# Altium schematic sheet Sheet1.SchDoc
size A; SheetNumber: 1; SheetTotal: 1
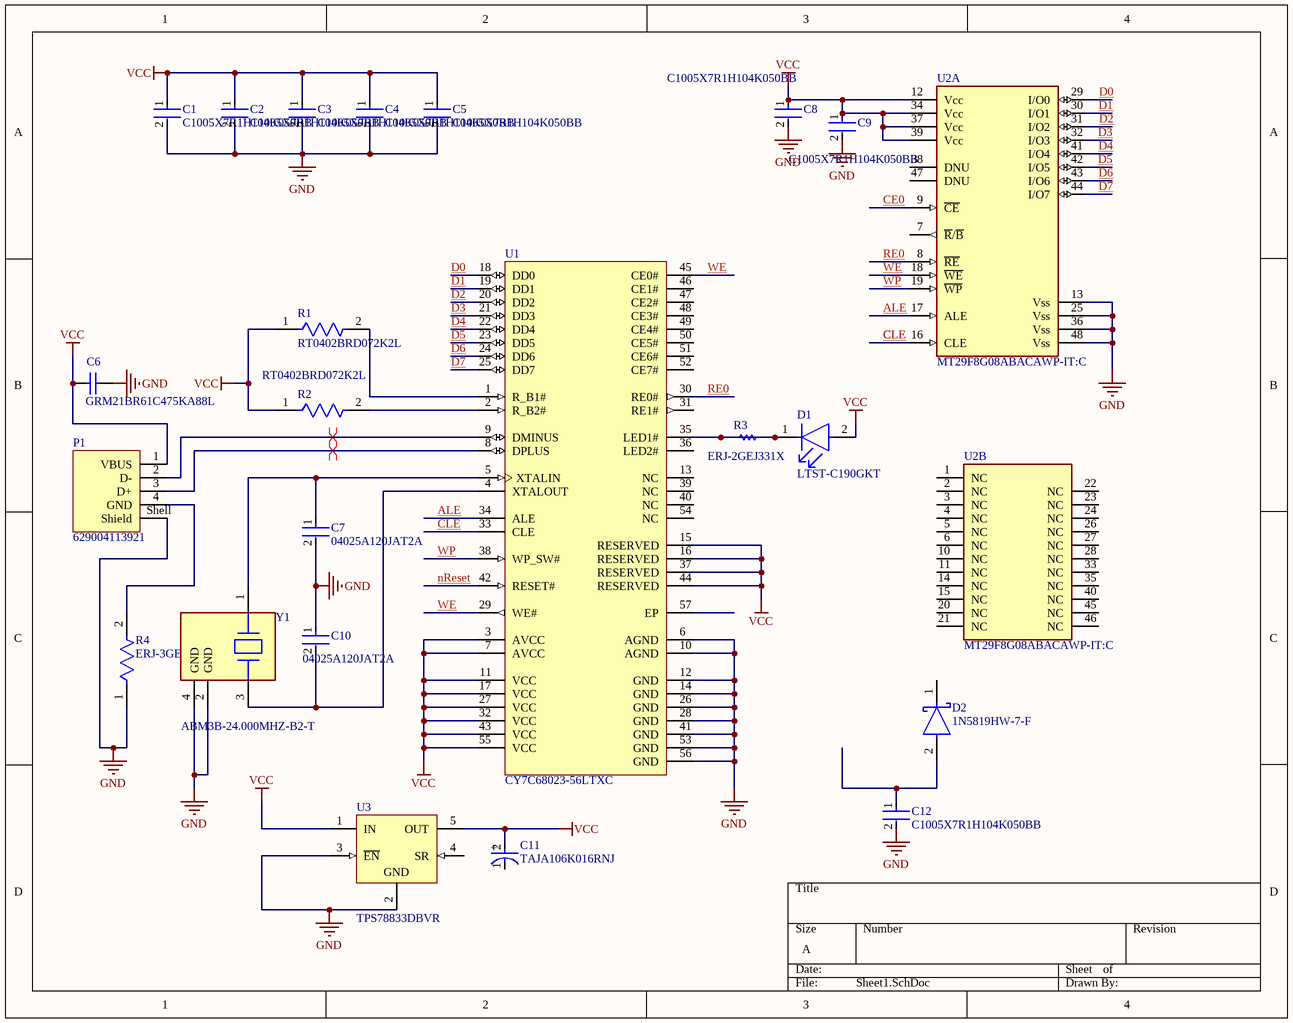
[diagram p0: Sheet1.SchDoc]

## Parts
C1  C1005X7R1H104K050BB  [FP-C1005-050-0_05-IPC_C]
C2  C1005X7R1H104K050BB  [FP-C1005-050-0_05-IPC_C]
C3  C1005X7R1H104K050BB  [FP-C1005-050-0_05-IPC_C]
C4  C1005X7R1H104K050BB  [FP-C1005-050-0_05-IPC_C]
C5  C1005X7R1H104K050BB  [FP-C1005-050-0_05-IPC_C]
C6  GRM21BR61C475KA88L  [CAPC2013X135X45LL10T25]
C7  04025A120JAT2A  [FP-0402-L_1_0_1-W_0_5_0_1-IPC_B]
C8  C1005X7R1H104K050BB  [FP-C1005-050-0_05-IPC_C]
C9  C1005X7R1H104K050BB  [FP-C1005-050-0_05-IPC_C]
C10  04025A120JAT2A  [FP-0402-L_1_0_1-W_0_5_0_1-IPC_B]
C11  TAJA106K016RNJ  [FP-TAJA-MFG]
C12  C1005X7R1H104K050BB  [FP-C1005-050-0_05-IPC_C]
D1  LTST-C190GKT  [FP-LTST-C190GKT-MFG]
D2  1N5819HW-7-F  [FP-SOD123-IPC_A]
P1  629004113921  [629004113921]
R1  RT0402BRD072K2L  [FP-RT0402-MFG]
R2  RT0402BRD072K2L  [FP-RT0402-MFG]
R3  ERJ-2GEJ331X  [RESC1005X40X25NL05T05]
R4  ERJ-3GEY0R00V  [FP-ERJ-3GEY0R00V-MFG]
U1  CY7C68023-56LTXC  [CYP-LTX56-5200X4500TP_M]
U2  MT29F8G08ABACAWP-IT:C  [FP-WP-IPC_C]  (parts A,B of 2)
U3  TPS78833DBVR  [DBV0005A_M]
Y1  ABM3B-24.000MHZ-B2-T  [FP-ABM3B-MFG]

## Nets
GND: C1.2 C2.2 C3.2 C4.2 C5.2 C6.2 C7.2 C8.2 C9.2 C10.1 C12.2 P1.Shell(Shield) R4.1 U1.6(AGND) U1.10(AGND) U1.12(GND) U1.14(GND) U1.26(GND) U1.28(GND) U1.41(GND) U1.53(GND) U1.56(GND) U2.13(Vss) U2.25(Vss) U2.36(Vss) U2.48(Vss) U3.2(GND) U3.3(~{EN}) Y1.2(GND) Y1.4(GND)
VCC: C1.1 C2.1 C3.1 C4.1 C5.1 C6.1 C8.1 C9.1 C11.2(A) D1.2(A) P1.1(VBUS) R1.1 R2.1 U1.3(AVCC) U1.7(AVCC) U1.11(VCC) U1.15(RESERVED) U1.16(RESERVED) U1.17(VCC) U1.27(VCC) U1.32(VCC) U1.37(RESERVED) U1.43(VCC) U1.44(RESERVED) U1.55(VCC) U2.12(Vcc) U2.34(Vcc) U2.37(Vcc) U2.39(Vcc) U3.1(IN) U3.5(OUT)
ALE: U1.34(ALE) U2.17(ALE)
CE0: U2.9(~{CE})
CLE: U1.33(CLE) U2.16(CLE)
D0: U1.18(DD0) U2.29(I/O0)
D1: U1.19(DD1) U2.30(I/O1)
D2: U1.20(DD2) U2.31(I/O2)
D3: U1.21(DD3) U2.32(I/O3)
D4: U1.22(DD4) U2.41(I/O4)
D5: U1.23(DD5) U2.42(I/O5)
D6: U1.24(DD6) U2.43(I/O6)
D7: U1.25(DD7) U2.44(I/O7)
nReset: U1.42(RESET#)
RE0: U1.30(RE0#) U2.8(~{RE})
WE: U1.29(WE#) U1.45(CE0#) U2.18(~{WE})
WP: U1.38(WP_SW#) U2.19(~{WP})
NetC7_1: C7.1 U1.5(XTALIN) Y1.1
NetC10_2: C10.2 U1.4(XTALOUT) Y1.3
NetC12_1: C12.1 D2.2(A)
NetD1_1: D1.1(C) R3.1 R3.2 U1.35(LED1#)
NetP1_2: P1.2(D-) U1.9(DMINUS)
NetP1_3: P1.3(D+) U1.8(DPLUS)
NetP1_4: P1.4(GND) R4.2
NetR1_2: R1.2 U1.1(R_B1#)
NetR2_2: R2.2 U1.2(R_B2#)

Not connected (* = marked no-connect by the designer): C11 1(C); D2 1(C); U1 13(NC) 31(RE1#) 36(LED2#) 39(NC) 40(NC) 46(CE1#) 47(CE2#) 48(CE3#) 49(CE4#) 50(CE5#) 51(CE6#) 52(CE7#) 54(NC) 57(EP); U2 1(NC) 2(NC) 3(NC) 4(NC) 5(NC) 6(NC) 7(~{R}/~{B}) 10(NC) 11(NC) 14(NC) 15(NC) 20(NC) 21(NC) 22(NC) 23(NC) 24(NC) 26(NC) 27(NC) 28(NC) 33(NC) 35(NC) 38(DNU) 40(NC) 45(NC) 46(NC) 47(DNU); U3 4(SR)

## Layout directives
differential pair: NetP1_2, NetP1_3

## Notes on the sheet
- (in symbol CMP-1661-00004-2) +

## Library data of the parts
C1-C5 C8 C9 C12 = CMP-2000-05393-2: Multilayer Ceramic Capacitors 100nF ±10% 50V X7R SMD 0402; Voltage: 50V; Dielectric Material: Ceramic; Min Operating Temperature: -55°C; Depth: 0.5mm; Radiation Hardening: No; RoHS Compliant: Yes; Voltage Rating (DC): 50V; Lead Free: Lead Free; Resistor Type: Ceramic; Height: 0.5mm; Dielectric: X7R; Thickness: 0.022inch; Case/Package: 0402; Case Code (Metric): 1005; Termination: SMD/SMT; Capacitance: 100nF; Packaging: Tape and Reel; Max Operating Temperature: 125°C; Mount: Surface Mount; Package Quantity: 1; Width: 0.02inch; Weight: 2.3E-05oz; Voltage Rating: 50V; Tolerance: 10%; Construction: Flat; Case Code (Imperial): 0402; Length: 1mm; REACH SVHC: No SVHC; Series: C
C6 = CMP-1662-00015-2: Chip Capacitor, 4.7 uF, +/- 10%, 16 V, -55 to 85 degC, 0805 (2012 Metric), RoHS, Tape and Reel; Voltage Rating (DC): 16 V; Capacitance: 4.7 uF; Type (Capacitors): X5R; Case\/Package: 0805; Pins: 2; DatasheetVersion: 03/2016; REACH SVHC: No SVHC; Tolerance: 10%; PartNumber: GRM21BR61C475KA88L; Width: 1.25 mm; Mount: Surface Mount; ComponentLink1Description: Manufacturer URL; Case Code (Metric): 2012; PackageDescription: 2-Pin Surface Mount Device, Body 2 x 1.25 mm; Height: 1.25 mm; Voltage Rating: 16 V; Max Operating Temperature: 85 degC; RoHSCompliant: true; Length: 2 mm; ComponentLink1URL: http://www.murata.com/; Mounting Technology: Surface Mount; Packaging: Tape and Reel; Min Operating Temperature: -55 degC; ComponentLink2Description: Datasheet; Case Code (Imperial): 0805; Radiation Hardening: No; Package Quantity: 3000; PackageReference: 0805; ComponentLink2URL: http://search.murata.co.jp/Ceramy/image/img/A01X/G101/ENG/GRM21BR61C475KA88-01.pdf
C7 C10 = CMP-2008-02574-2: General Purpose Ceramic Capacitor, 0402, 12pF, 5%, C0G, 30ppm/°C, 50V; Insulation Resistance: 100GR; Radiation Hardening: No; RoHS Compliant: Yes; Voltage Rating: 50V; Case Code (Imperial): 0402; Height: 0.5mm; Voltage: 50V; Voltage Rating (DC): 50V; Mount: Surface Mount; Capacitance: 12pF; Thickness: 0.022inch; Depth: 0.5mm; Max Operating Temperature: 125°C; Construction: Flat; Termination: SMD/SMT; Tolerance: 5%; Length: 1mm; Lead Free: Lead Free; Dielectric: C0G; Number of Pins: 2; Package Quantity: 1; Series: -; Temperature Coefficient: 30ppm/°C; Min Operating Temperature: -55°C; Case/Package: 0402; Packaging: Tape and Reel; Case Code (Metric): 1005; Width: 0.02inch; REACH SVHC: No SVHC
C11 = CMP-1661-00004-2: 10uF 16V  ±10% 3Ω 1206  SMD Tantalum Capacitor; ESR (Equivalent Series Resistance): 3R; Leakage Current: 1.6uA; Dissipation Factor: 8%; Polarity: Polar; Length: 3.2mm; Features: General Purpose; Voltage Rating: 16V; Voltage: 16V; Mount: Surface Mount; Case/Package: 1206; Number of Pins: 2; Case Code (Metric): 3216; Radiation Hardening: No; Min Operating Temperature: -55°C; Case Code (Imperial): 1206; Height - Seated (Max): 0.071inch; Lead Free: Lead Free; Termination: SMD/SMT; Dielectric Material: Tantalum; Width: 1.6mm; Tolerance: 10%; Capacitance: 10uF; Lead Pitch: 1.1mm; Max Operating Temperature: 125°C; Voltage Rating (DC): 16V; Packaging: Tape and Reel; Package Quantity: 1; REACH SVHC: No SVHC; Depth: 1.6mm; Height: 1.6mm
D1 = CMP-22017-000005-2: LED GREEN CLEAR CHIP SMD; Dominant Wavelength: 569nm; Reverse Voltage: 5V; Lens Color: Colorless; Viewing Angle: 130°; Voltage: 2V; Forward Current: 30mA; Power Dissipation: 100mW; Luminous Intensity: 6mcd; Number of LEDs: 1; Forward Voltage: 2.1V; Wavelength: 565nm; Test Current: 10mA; Min Operating Temperature: -55°C; Lens Style: Clear; Mount: Surface Mount; Width: 0.8mm; Packaging: Tape and Reel; Lens Transparency: Clear; Case Code (Metric): 1608; Depth: 0.8mm; Case Code (Imperial): 0603; Case/Package: 0603; Number of Pins: 2; Max Operating Temperature: 85°C; Lead Free: Lead Free; Number of Elements: 1; Length: 1.6mm; Height: 0.8mm; Package Quantity: 1; Power Rating: 100mW; Radiation Hardening: No; Illumination Color: Green; Color: Green
D2 = CMP-0303-00003-3: DIODE SCHOTTKY 40V 1A SOD123; Forward Voltage: 450mV; Capacitance: 110pF; Max Forward Surge Current (Ifsm): 25A; Peak Reverse Current: 50uA; Polarity: Standard; Element Configuration: Single; Max Power Dissipation: 450mW; Min Operating Temperature: -65°C; Package Quantity: 3000; Contact Plating: Tin; Weight: 0.000353oz; Max Repetitive Reverse Voltage (Vrrm): 40V; Max Reverse Voltage (DC): 40V; Height: 1.25mm; Average Rectified Current: 1A; Width: 1.7mm; Case/Package: SOD-123-2; Lead Free: Lead Free; Max Operating Temperature: 125°C; Current Rating: 1A; Termination: SMD/SMT; Forward Current: 1A; Radiation Hardening: No; Number of Pins: 2; Length: 2.85mm; Voltage Rating (DC): 40V; REACH SVHC: No SVHC; Peak Non-Repetitive Surge Current: 25A; Packaging: Tape and Reel; Output Current: 1A
P1 = CMP-1502-03242-2: NexarPartId: 19991169; USB Standard: USB 2.0; Gender: Male; Connector Type: USB; Contact Resistance: 20mΩ; Current Rating: 1.5A; Number of Contacts: 4; Insulation Resistance: 1GΩ; Operating Supply Voltage: 30V; Termination: SMD/SMT; Lead Free: Lead Free; Max Operating Temperature: 105°C; Mount: Horizontal, Surface Mount; Features: Shielded; Orientation: Horizontal; Length: 18.8mm; REACH SVHC: Unknown; Min Operating Temperature: -40°C; Contact Plating: Gold; Number of Pins: 4; RoHS: Compliant
R1 R2 = CMP-2002-02636-2: RES SMD 2.2K OHM 0.1% 1/16W 0402; Manufacturer: Yageo; Temperature Coefficient: 25 ppm/°C; Voltage Rating: 50V; Power Rating: 0.063W; Tolerance: 0.001; Value: 2.2KΩ; Automotive: No; Series: RT; Category: Res; Device Class L1: Passive Components; Temperature Range Low: -55°C; Temperature Range High: +155°C; Package: RT0402; Ipc Land Pattern Name: RESC10050X30; ComponentLink2URL: http://www.yageo.com/documents/recent/PYu-RT_1-to-0.01_RoHS_L_9.pdf; Composition: Thin Film; ComponentLink2Description: Datasheet; Device Class L2: Resistors; RoHS: TRUE; Height: 0.35mm; Footprint Url: http://www.yageo.com/exep/pages/download/literatures/PYu-R_Mount_10.pdf; Digikey Description: RES SMD 2.2K OHM 0.1% 1/16W 0402; Mouser Description: Thin Film Resistors 1/16W 2.2K ohm .1% 25ppm; Temperature: -55°C to +155°C; Octopart: https://octopart.com/rt0402brd072k2l-yageo-1369928; Device Class L3: Chip SMD Resistors; Manufacturer Part Number: RT0402BRD072K2L; Lead Free: Yes; Resistance: 2.2KΩ
R3 = CMP-2002-00515-1: Manufacturer: Panasonic; Part Number: ERJ-2GEJ331X
R4 = CMP-2000-00700-2: RES SMD 0 OHM JUMPER 1/10W 0603; Manufacturer: Panasonic; Tolerance: 5%; Automotive Grade: Grade 0; Voltage Rating: 75V; Value: 0Ω; Temperature Coefficient: -100/+600ppm/°C; Power Rating: 0.1W; Mouser Description: Resistor, Chip Thick Film, 0 Ohm, 0.1w, Resistor, Chip Thick Film, 0 Ohm, 0.1w, 5%; Manufacturer Part Number: ERJ-3GEY0R00V; Ipc Land Pattern Name: RESC16080X45; Category: Res; Package: 0603; Temperature: -55°C to +155°C; Temperature Range Low: -55°C; Series: ERJ; Resistance: 0Ω; RoHS: TRUE; Composition: Thick Film; Octopart: https://octopart.com/erj-3gey0r00v-panasonic-55389238; Device Class L1: Passive Components; Footprint Url: https://industrial.panasonic.com/cdbs/www-data/pdf/RDA0000/DMA0000COL17.pdf; ComponentLink2Description: Datasheet; Device Class L2: Resistors; Temperature Range High: +155°C; Digikey Description: RES SMD 0 OHM JUMPER 1/10W 0603; Lead Free: Yes; Device Class L3: Chip SMD Resistors; Height: 0.55mm; ComponentLink2URL: https://industrial.panasonic.com/cdbs/www-data/pdf/RDA0000/AOA0000C301.pdf; Automotive: Yes
U1 = CMP-0967-00114-2: EZ-USB NX2LP(TM) USB 2.0 NAND Flash Controller, 8 I/Os, 3 to 3.6 V, 0 to 70 degC, 56-Pin QFN (LTX56), Tray; Manufacturer: Cypress; Max. Operating Voltage (V): 3.6; No. of I/Os: 8; Min. Operating Voltage (V): 3; ComponentLink2Description: Datasheet; Code_JEDEC: MO-220; Max. Operating Temp. (degreesC): 70; PartNumber: CY7C68023-56LTXC; PackageReference: LTX56; DatasheetVersion: Rev. *G; PackageDescription: 56-Pin Sawn QFN, Body 8 x 8 mm, Pitch 0.5 mm; ComponentLink3Description: Package Specification; Min. Operating Temp. (degreesC): 0; ComponentLink3URL: http://www.cypress.com/?docID=47572; ComponentLink2URL: http://www.cypress.com/?docID=38242; ComponentLink1URL: http://www.cypress.com/; ComponentLink1Description: Manufacturer URL; Mounting Technology: Surface Mount; PackageVersion: Rev. *D; RoHS: Pb-Free; Packing: Tray
U2 = CMP-14958-000015-1: IC FLASH 8GBIT PARALLEL 48TSOP I; Supply Current: 35mA; Word Size: 8b; Density: 8Gb; Address Bus Width: 31b; Max Supply Voltage: 3.6V; Min Supply Voltage: 2.7V; Memory Size: 1000000000B; Operating Supply Voltage: 3.3V; Sync/Async: Asynchronous; Page Size: 4KB; Memory Type: FLASH; Min Operating Temperature: -40°C; Interface: Parallel; Mount: Surface Mount; Radiation Hardening: No; Series: -; Number of Pins: 48; Max Operating Temperature: 85°C; Nominal Supply Current: 35mA; Contact Plating: Tin; Case/Package: TFSOP
U3 = CMP-0394-00627-2: Single Output Low Noise LDO, 150 mA, Fixed 3.3 V Output, 2.7 to 10 V Input, with Low IQ, 5-pin SOT-23 (DBV), 0 to 70 degC, Green (RoHS & no Sb/Br); Manufacturer: Texas Instruments; Vdo(Typ)(mV): 150; Iout(Max)(A): 0.1; Vin(Min)(V): 2.7; Vout Adj(Min)(V): 3.3; Vin(Max)(V): 10; SubFamily: Single Channel LDO; Iq(Typ)(mA): 0.02; Accuracy(%): 3; Code_JEDEC: MO-178; PackageDescription: 5-Pin Plastic Small Outline, Body 1.60 Ãƒâ€” 2.90 mm, Pitch 0.95 mm; Eco-Plan: Green (RoHS & no Sb/Br); PartNumber: TPS78833DBVR; ComponentLink3URL: http://www.ti.com/litv/pdf/mpds018i; ComponentLink1URL: http://www.ti.com/; PackageVersion: 4073253-4/K; DatasheetVersion: SLVS382A; ComponentLink1Description: Manufacturer URL; Mounting Technology: Surface Mount; Vout Adj(Max)(V): 3.3; PackageReference: DBV0005A; ComponentLink2Description: Datasheet; Fixed Output Options(V): 3.3; ComponentLink2URL: http://www.ti.com/general/docs/lit/getliterature.tsp?genericPartNumber=TPS78833&fileType=pdf; ComponentLink3Description: Package Specification
Y1 = CMP-1688-00008-2: Crystal 24MHz ±20ppm 18pF SMD-4 5mm x 3.2mm; ESR (Equivalent Series Resistance): 50R; Frequency Stability: 50ppm; Number of Pins: 4; Lead Free: Lead Free; Packaging: Tape and Reel; Tolerance: 20ppm; Series: ABM3B; Height: 0.043inch; Load Capacitance: 18pF; Length: 5mm; Depth: 3.2mm; Mount: Surface Mount; Resistor Type: Ceramic; Case/Package: CSMD; Termination: SMD/SMT; Width: 0.126inch; Frequency: 24MHz; Max Operating Temperature: 70°C; Frequency Tolerance: 20ppm; REACH SVHC: No SVHC; Package Quantity: 1000; Min Operating Temperature: -20°C; Series Resistance: 50R; Operating Frequency: 24 MHz